# EAGLE design CIRCLE (EAGLE 9.6.2)
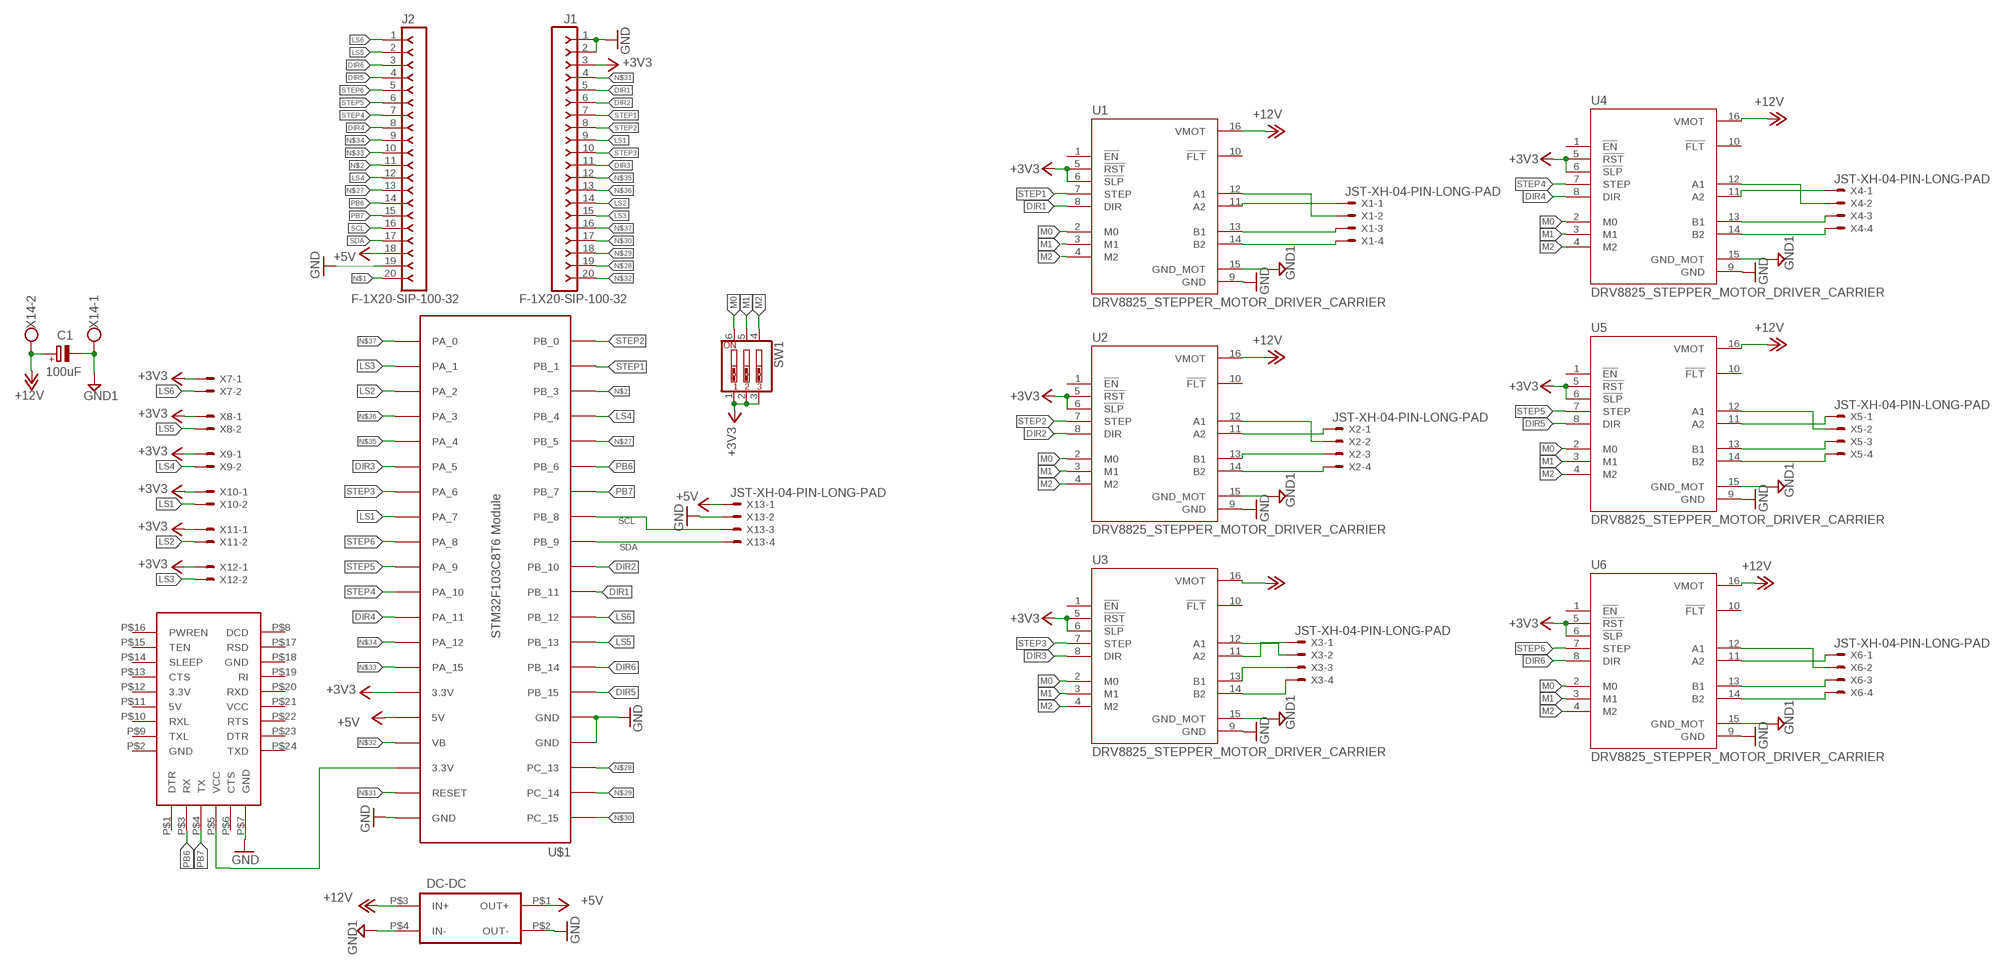
[diagram p0: schematic, sheet 1]

## Parts
C1  100uF  CPOL-EUE3.5-8  [E3,5-8]
J1  F-1X20-SIP-100-32  [SIP-100-20-32]
J2  F-1X20-SIP-100-32  [SIP-100-20-32]
SW1  SW_DIP-3  [EDG-03]
U1  DRV8825_STEPPER_MOTOR_DRIVER_CARRIER  [IC_DRV8825_STEPPER_MOTOR_DRIVER_CARRIER]
U2  DRV8825_STEPPER_MOTOR_DRIVER_CARRIER  [IC_DRV8825_STEPPER_MOTOR_DRIVER_CARRIER]
U3  DRV8825_STEPPER_MOTOR_DRIVER_CARRIER  [IC_DRV8825_STEPPER_MOTOR_DRIVER_CARRIER]
U4  DRV8825_STEPPER_MOTOR_DRIVER_CARRIER  [IC_DRV8825_STEPPER_MOTOR_DRIVER_CARRIER]
U5  DRV8825_STEPPER_MOTOR_DRIVER_CARRIER  [IC_DRV8825_STEPPER_MOTOR_DRIVER_CARRIER]
U6  DRV8825_STEPPER_MOTOR_DRIVER_CARRIER  [IC_DRV8825_STEPPER_MOTOR_DRIVER_CARRIER]
U$1  STM32F103C8T6-MODULE  [STM32F103C8T6-MODULE]
U$2  DC-DC_CONV  [DC-DC_CONV]
U$3  FT232RL_FTDI  [FT232RL_FTDI]
X1  JST-XH-04-PIN-LONG-PAD  [JST-XH-04-PACKAGE-LONG-PAD]
X2  JST-XH-04-PIN-LONG-PAD  [JST-XH-04-PACKAGE-LONG-PAD]
X3  JST-XH-04-PIN-LONG-PAD  [JST-XH-04-PACKAGE-LONG-PAD]
X4  JST-XH-04-PIN-LONG-PAD  [JST-XH-04-PACKAGE-LONG-PAD]
X5  JST-XH-04-PIN-LONG-PAD  [JST-XH-04-PACKAGE-LONG-PAD]
X6  JST-XH-04-PIN-LONG-PAD  [JST-XH-04-PACKAGE-LONG-PAD]
X7  JST-XH-02-PIN-LONG-PAD  [JST-XH-02-PACKAGE-LONG-PAD]
X8  JST-XH-02-PIN-LONG-PAD  [JST-XH-02-PACKAGE-LONG-PAD]
X9  JST-XH-02-PIN-LONG-PAD  [JST-XH-02-PACKAGE-LONG-PAD]
X10  JST-XH-02-PIN-LONG-PAD  [JST-XH-02-PACKAGE-LONG-PAD]
X11  JST-XH-02-PIN-LONG-PAD  [JST-XH-02-PACKAGE-LONG-PAD]
X12  JST-XH-02-PIN-LONG-PAD  [JST-XH-02-PACKAGE-LONG-PAD]
X13  JST-XH-04-PIN-LONG-PAD  [JST-XH-04-PACKAGE-LONG-PAD]
X14  W237-102  [W237-102]

## Nets
+3V3: J1.3 SW1.1 SW1.2 SW1.3 U1.5(!RST) U1.6(!SLP) U2.5(!RST) U2.6(!SLP) U3.5(!RST) U3.6(!SLP) U4.5(!RST) U4.6(!SLP) U5.5(!RST) U5.6(!SLP) U6.5(!RST) U6.6(!SLP) U$1.3.3V@2(3.3V) X7.1 X8.1 X9.1 X10.1 X11.1 X12.1
+5V: J2.18 U$1.5V U$2.P$1(OUT+) X13.1
+12V: C1.+ U1.16(VMOT) U2.16(VMOT) U3.16(VMOT) U4.16(VMOT) U5.16(VMOT) U6.16(VMOT) U$2.P$3(IN+) X14.2
DIR1: J1.5 U1.8(DIR) U$1.PB_11
DIR2: J1.6 U2.8(DIR) U$1.PB_10
DIR3: J1.11 U3.8(DIR) U$1.PA_5
DIR4: J2.8 U4.8(DIR) U$1.PA_11
DIR5: J2.4 U5.8(DIR) U$1.PB_15
DIR6: J2.3 U6.8(DIR) U$1.PB_14
GND: J1.1 J1.2 J2.19 U1.9(GND) U2.9(GND) U3.9(GND) U4.9(GND) U5.9(GND) U6.9(GND) U$1.GND@1(GND) U$1.GND@2(GND) U$1.GND@3(GND) U$2.P$2(OUT-) U$3.P$7(GND) X13.2
GND1: C1.- U1.15(GND_MOT) U2.15(GND_MOT) U3.15(GND_MOT) U4.15(GND_MOT) U5.15(GND_MOT) U6.15(GND_MOT) U$2.P$4(IN-) X14.1
LS1: J1.9 U$1.PA_7 X10.2
LS2: J1.14 U$1.PA_2 X11.2
LS3: J1.15 U$1.PA_1 X12.2
LS4: J2.12 U$1.PB_4 X9.2
LS5: J2.2 U$1.PB_13 X8.2
LS6: J2.1 U$1.PB_12 X7.2
M0: SW1.6 U1.2(M0) U2.2(M0) U3.2(M0) U4.2(M0) U5.2(M0) U6.2(M0)
M1: SW1.5 U1.3(M1) U2.3(M1) U3.3(M1) U4.3(M1) U5.3(M1) U6.3(M1)
M2: SW1.4 U1.4(M2) U2.4(M2) U3.4(M2) U4.4(M2) U5.4(M2) U6.4(M2)
N$1: J2.20 U$1.3.3V@1(3.3V) U$3.P$5(VCC)
N$2: J2.11 U$1.PB_3
N$3: U1.14(B2) X1.4
N$4: U1.13(B1) X1.3
N$5: U1.12(A1) X1.2
N$6: U1.11(A2) X1.1
N$7: U2.14(B2) X2.4
N$8: U2.13(B1) X2.3
N$9: U2.11(A2) X2.1
N$10: U2.12(A1) X2.2
N$11: U4.14(B2) X4.4
N$12: U4.13(B1) X4.3
N$13: U4.11(A2) X4.1
N$14: U4.12(A1) X4.2
N$15: U5.14(B2) X5.4
N$16: U5.13(B1) X5.3
N$17: U5.11(A2) X5.1
N$18: U5.12(A1) X5.2
N$19: U6.14(B2) X6.4
N$20: U6.13(B1) X6.3
N$21: U6.11(A2) X6.1
N$22: U6.12(A1) X6.2
N$23: U3.14(B2) X3.4
N$24: U3.13(B1) X3.3
N$25: U3.11(A2) X3.1
N$26: U3.12(A1) X3.2
N$27: J2.13 U$1.PB_5
N$28: J1.19 U$1.PC_13
N$29: J1.18 U$1.PC_14
N$30: J1.17 U$1.PC_15
N$31: J1.4 U$1.RESET
N$32: J1.20 U$1.VB
N$33: J2.10 U$1.PA_15
N$34: J2.9 U$1.PA_12
N$35: J1.12 U$1.PA_4
N$36: J1.13 U$1.PA_3
N$37: J1.16 U$1.PA_0
PB6: J2.14 U$1.PB_6 U$3.P$3(RX)
PB7: J2.15 U$1.PB_7 U$3.P$4(TX)
SCL: J2.16 U$1.PB_8 X13.3
SDA: J2.17 U$1.PB_9 X13.4
STEP1: J1.7 U1.7(STEP) U$1.PB_1
STEP2: J1.8 U2.7(STEP) U$1.PB_0
STEP3: J1.10 U3.7(STEP) U$1.PA_6
STEP4: J2.7 U4.7(STEP) U$1.PA_10
STEP5: J2.6 U5.7(STEP) U$1.PA_9
STEP6: J2.5 U6.7(STEP) U$1.PA_8
Unconnected: U1.1(!EN) U1.10(!FLT) U2.1(!EN) U2.10(!FLT) U3.1(!EN) U3.10(!FLT) U4.1(!EN) U4.10(!FLT) U5.1(!EN) U5.10(!FLT) U6.1(!EN) U6.10(!FLT) U$3.P$1(DTR) U$3.P$2(GND) U$3.P$6(CTS) U$3.P$8(DCD) U$3.P$9(TXL) U$3.P$10(RXL) U$3.P$11(5V) U$3.P$12(3.3V) U$3.P$13(CTS) U$3.P$14(SLEEP) U$3.P$15(TEN) U$3.P$16(PWREN) U$3.P$17(RSD) U$3.P$18(GND) U$3.P$19(RI) U$3.P$20(RXD) U$3.P$21(VCC) U$3.P$22(RTS) U$3.P$23(DTR) U$3.P$24(TXD)

## Library data of the parts
C1 = rcl:CPOL-EU: POLARIZED CAPACITOR, European symbol; SPICEPREFIX: C
J1 J2 = con-headers-jp female:F-1X20-: FEMALE HEADER
SW1 = special:SW_DIP-3: DIP SWITCH
U1-U6 = DRV8825_STEPPER_MOTOR_DRIVER_CARRIER:DRV8825_STEPPER_MOTOR_DRIVER_CARRIER: Stepper motor controler; IC: DRV8825; 1.5A; Uin mot: 8.2÷45V; AVAILABILITY: Unavailable; DESCRIPTION: Stepper, Bipolar 8.2 ~ 45VDC Supply 1.5A 8.2 ~ 45V Load; MF: Pololu; MP: DRV8825 STEPPER MOTOR DRIVER CARRIER; PACKAGE: None; PRICE: None
U$1 = STM32 F103C8T6:STM32F103C8T6-MODULE: STM32F103C8T6 module with ARM Cortex-3, 20kB SRAM, 64kB Flash, 72MHz
U$2 = MINI360:DC-DC_CONV
U$3 = FT232RL_FTDI:FT232RL_FTDI
X1-X6 X13 = Rembrandt Electronics - JST XH Connectors v1-0:JST-XH-04-PIN: JST XH Connector 2 Pin Wire to board connector. Pitch: 2,54 mm, (0.100") Number of pins: 4 Created by Rembrandt Electronics www.rembrandtelectronics.com
X7-X12 = Rembrandt Electronics - JST XH Connectors v1-0:JST-XH-02-PIN: JST XH Connector 2 Pin Wire to board connector. Pitch: 2,54 mm, (0.100") Number of pins: 2 Created by Rembrandt Electronics www.rembrandtelectronics.com
X14 = con-wago-500:W237-102: WAGO SCREW CLAMP; MPN: 237-102; OC_FARNELL: unknown; OC_NEWARK: 70K9898

## Board
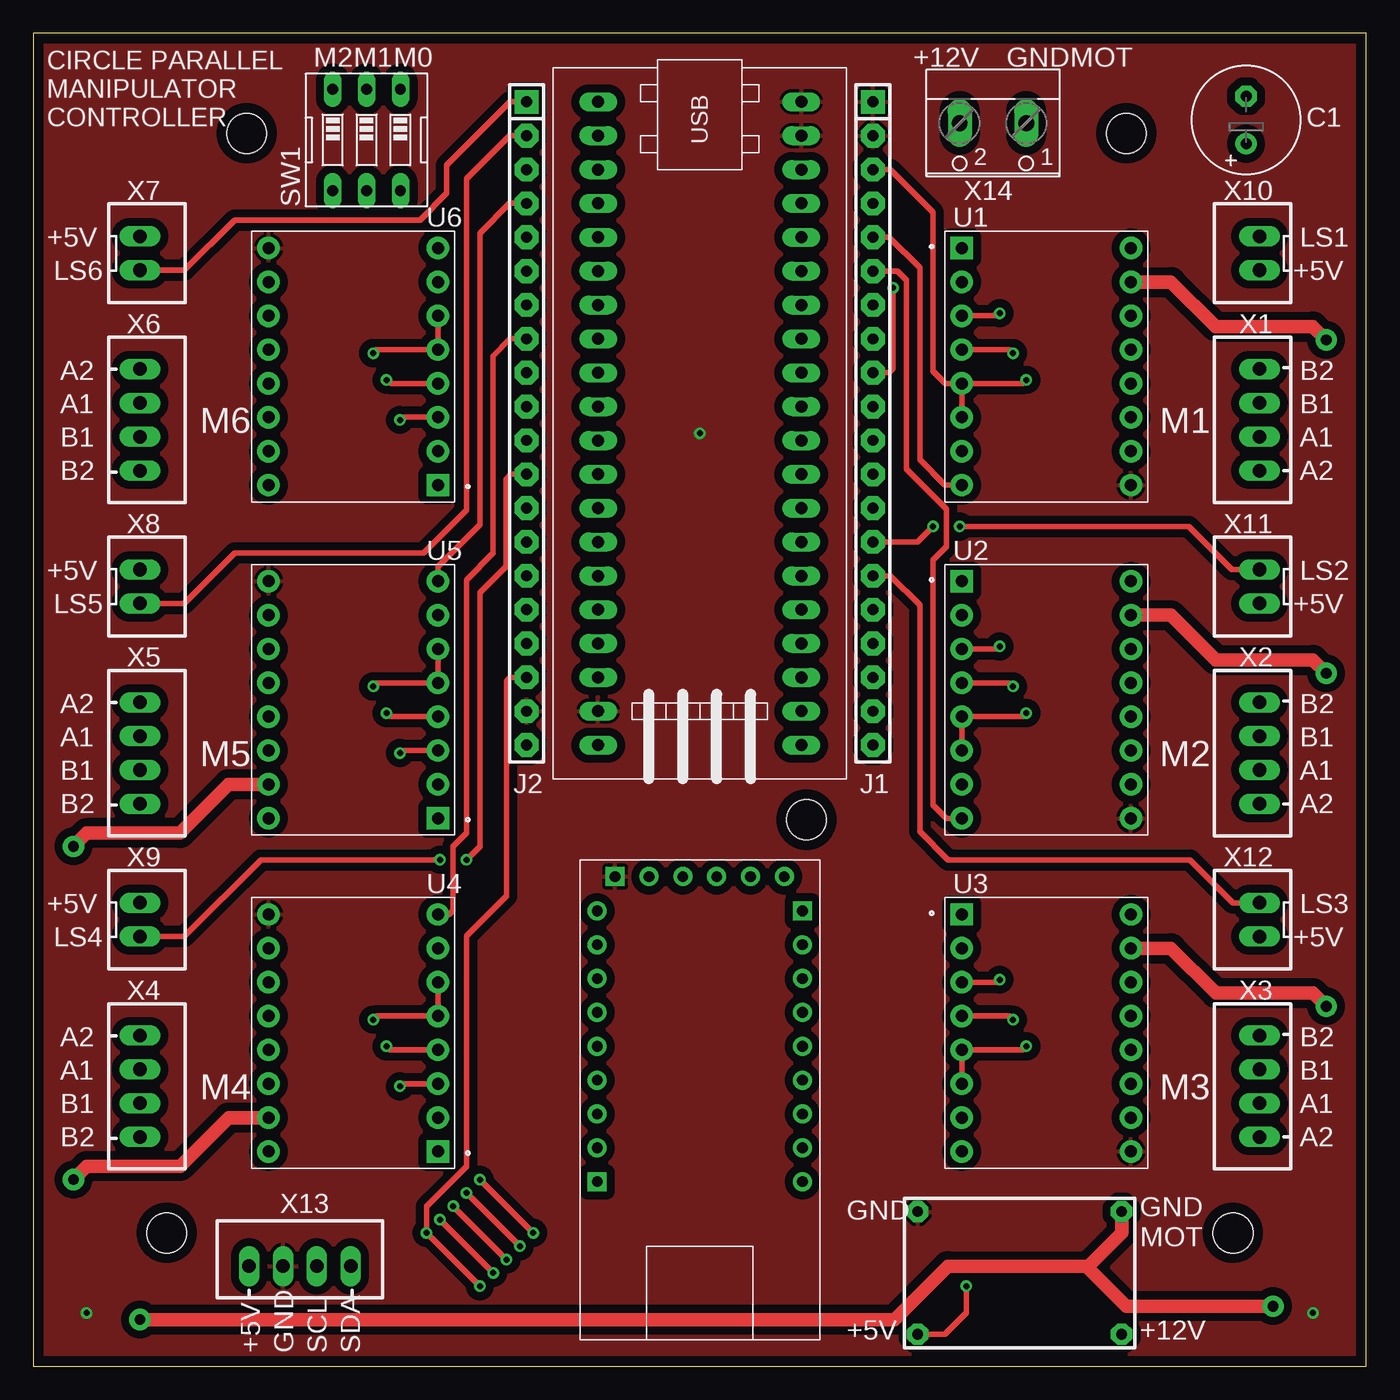
[diagram p1: board, top side]
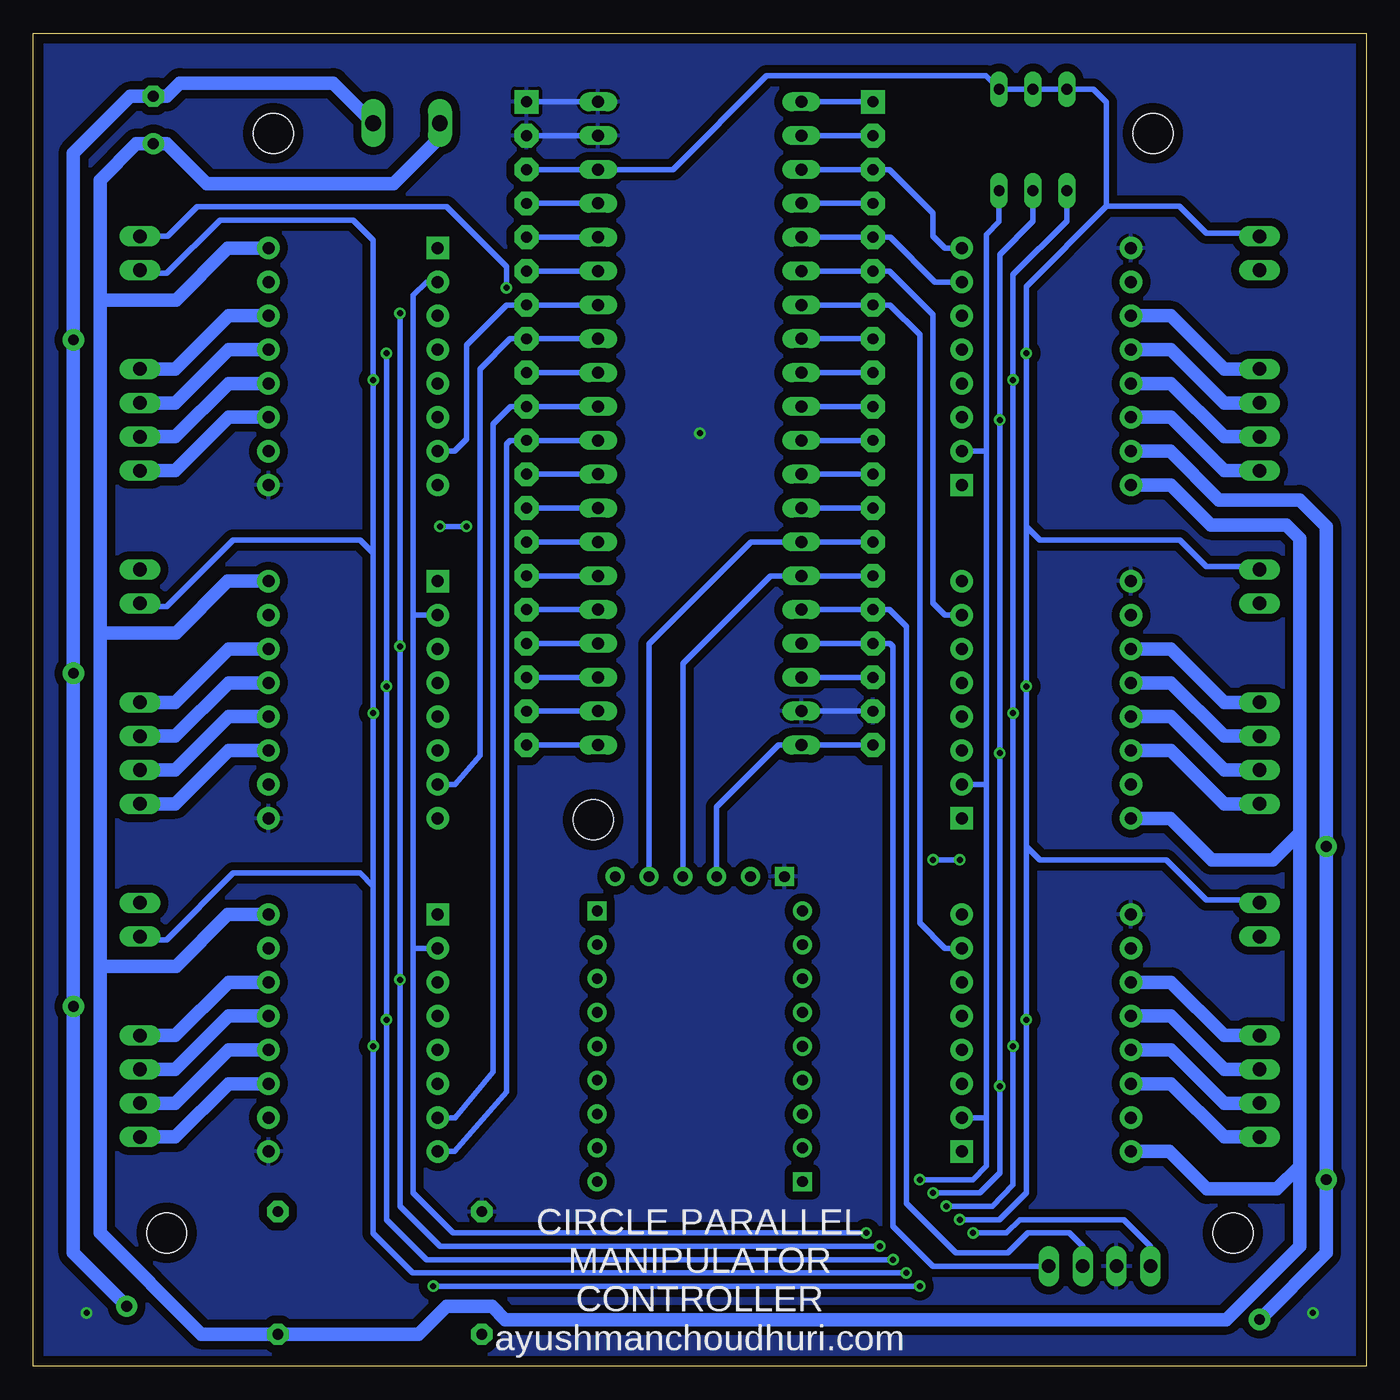
[diagram p2: board, bottom side, seen from below]

Size 100 x 100 mm. Coordinates in mm from the lower left corner, seen from the top.
Outline: 0,100 0,0 100,0 100,100 0,100
Copper layers (1*16): Top 0.035mm / dielectric 1.5mm / Bottom 0.035mm
Design rules "default *": minimum track width 6mil, minimum drill 0.35mm, track to track 6mil, track to pad 6mil, pad to pad 6mil, via to via 6mil, smd to smd 6mil, copper to edge 30mil, drill to drill 6mil, minimum pad ring 10mil, minimum via ring 8mil, stop-mask expansion 4mil, vias tented up to drill 0mil, thermal gap 10mil
Holes 3 mm at 82,92.5 58,41 90,10 10,10 16,92.5

### Footprints (pad centres in the part's own frame; a part is rotated, then mirrored left to right if it is on the bottom)
E3,5-8 = drill 0.813 pad 1.6: + -1.778,0 | drill 0.813 pad 1.6 octagon: - 1.778,0
SIP-100-20-32 = drill 0.813 pad 1.778 square: 1 -24.13,0 | drill 0.813 pad 1.778 octagon: 2 -21.59,0; 3 -19.05,0; 4 -16.51,0; 5 -13.97,0; 6 -11.43,0; 7 -8.89,0; 8 -6.35,0; 9 -3.81,0; 10 -1.27,0; 11 1.27,0; 12 3.81,0; 13 6.35,0; 14 8.89,0; 15 11.43,0; 16 13.97,0; 17 16.51,0; 18 19.05,0; 19 21.59,0; 20 24.13,0
EDG-03 = drill 0.813 long: 1 -2.54,-3.81; 2 0,-3.81; 3 2.54,-3.81; 4 2.54,3.81; 5 0,3.81; 6 -2.54,3.81
IC_DRV8825_STEPPER_MOTOR_DRIVER_CARRIER = drill 0.9 pad 1.676 square: 1 -6.35,8.89 | drill 0.9 pad 1.676: 2 -6.35,6.35; 3 -6.35,3.81; 4 -6.35,1.27; 5 -6.35,-1.27; 6 -6.35,-3.81; 7 -6.35,-6.35; 8 -6.35,-8.89; 9 6.35,-8.89; 10 6.35,-6.35; 11 6.35,-3.81; 12 6.35,-1.27; 13 6.35,1.27; 14 6.35,3.81; 15 6.35,6.35; 16 6.35,8.89
STM32F103C8T6-MODULE = drill 0.9 long: 3.3V@1 25.4,-7.62; 3.3V@2 -17.78,7.62; 5V 20.32,-7.62; GND@1 22.86,-7.62; GND@2 -20.32,7.62; GND@3 -22.86,7.62; PA_0 15.24,7.62; PA_1 12.7,7.62; PA_2 10.16,7.62; PA_3 7.62,7.62; PA_4 5.08,7.62; PA_5 2.54,7.62; PA_6 0,7.62; PA_7 -2.54,7.62; PA_8 -12.7,-7.62; PA_9 -10.16,-7.62; PA_10 -7.62,-7.62; PA_11 -5.08,-7.62; PA_12 -2.54,-7.62; PA_15 0,-7.62; PB_0 -5.08,7.62; PB_1 -7.62,7.62; PB_3 2.54,-7.62; PB_4 5.08,-7.62; PB_5 7.62,-7.62; PB_6 10.16,-7.62; PB_7 12.7,-7.62; PB_8 15.24,-7.62; PB_9 17.78,-7.62; PB_10 -10.16,7.62; PB_11 -12.7,7.62; PB_12 -22.86,-7.62; PB_13 -20.32,-7.62; PB_14 -17.78,-7.62; PB_15 -15.24,-7.62; PC_13 22.86,7.62; PC_14 20.32,7.62; PC_15 17.78,7.62; RESET -15.24,7.62; VB 25.4,7.62
DC-DC_CONV = drill 0.8 pad 1.6 octagon: P$1 -4.6,7.65; P$2 4.6,7.65; P$3 -4.6,-7.65; P$4 4.6,-7.65
FT232RL_FTDI = drill 0.8 pad 1.422: P$1 2.651,1.27; P$3 5.191,1.27; P$4 7.731,1.27; P$5 10.271,1.27; P$6 12.811,1.27; P$9 1.3,6.38; P$10 1.3,8.92; P$11 1.3,11.46; P$12 1.3,14; P$13 1.3,16.54; P$14 1.3,19.08; P$15 1.3,21.62; P$16 1.3,24.16; P$17 16.7,21.62; P$18 16.7,19.08; P$19 16.7,16.54; P$20 16.7,14; P$21 16.7,11.46; P$22 16.7,8.92; P$23 16.7,6.38; P$24 16.7,3.84 | drill 0.8 pad 1.422 square: P$2 1.3,3.84; P$7 15.351,1.27; P$8 16.7,24.16
JST-XH-04-PACKAGE-LONG-PAD = drill 1.016 long: 1 -3.81,0; 2 -1.27,0; 3 1.27,0; 4 3.81,0
JST-XH-02-PACKAGE-LONG-PAD = drill 1.016 long: 1 -1.27,0; 2 1.27,0
W237-102 = drill 1.194 long: 1 -2.5,-1.27; 2 2.5,-1.27

### Placement (x,y rotation side)
C1  91,93.5 90 top
J1  63,70.73 270 top
J2  37,70.73 270 top
SW1  25,92 180 top
U1  76,75 0 top
U2  76,50 0 top
U3  76,25 0 top
U4  24,25 180 top
U5  24,50 180 top
U6  24,75 180 top
U$1  50,72 270 top
U$2  74,7 90 top
U$3  59,38 180 top
X1  92,71 90 top
X2  92,46 90 top
X3  92,21 90 top
X4  8,21 270 top
X5  8,46 270 top
X6  8,71 270 top
X7  8,83.5 270 top
X8  8,58.5 270 top
X9  8,33.5 270 top
X10  92,83.5 90 top
X11  92,58.5 90 top
X12  92,33.5 90 top
X13  20,7.5 0 top
X14  72,92 180 top

### Tracks (layer width: path | path; a pad name or v marks a point on that pad's centre or on a via)
+3V3  (via drill 0.45)
  Top 0.406: v30.5,11 v34.5,7 | v74.5,74 74.23,73.73 U1.5 | v74.5,49 74.23,48.73 U2.5 U2.6 | v74.5,24 74.23,23.73 U3.5 U3.6 | U4.5 30,26.27 | 30,26.27 25.77,26.27 v25.5,26 | v25.5,51 25.77,51.27 U5.5 U5.6 | v25.5,76 25.77,76.27 U6.5 U6.6 | U4.6 30.35,26.62 30,26.27 | U1.5 U1.6 | J1.3 64.3,89.78 67.5,86.58 67.5,74.65 68.42,73.73 U1.5
  Bottom 0.406: 19.5,87.01 25.5,80.98 v25.5,76 25.5,63 | 19.5,87.01 19.5,94.85 20.46,95.81 SW1.3 SW1.2 SW1.1 28.54,96.81 44.99,96.81 52.02,89.78 U$1.3.3V@2 J1.3 | 25.5,63 v25.5,51 25.5,39 | 25.5,39 v25.5,26 25.5,13.01 27.5,11 v30.5,11 | 74.5,36 74.5,37 v74.5,49 74.5,61 | 74.5,36 v74.5,24 74.5,9.97 71.53,7 v34.5,7 | 74.5,61 v74.5,74 74.5,84.5 76,86 86,86 90,82 91.77,82 X10.1 | X8.1 8.23,60 12,60 14,62 24.5,62 25.5,63 | 25.5,39 24.5,38 15,38 12,35 8.23,35 X9.1 | X7.1 8.23,85 12,85 14.01,87.01 19.5,87.01 | X12.1 91.77,32 90,32 85,37 76,37 75.5,37 74.5,36 | X11.1 91.77,57 90,57 85,62 75.5,62 74.5,61
+5V  (via drill 0.45)
  Top 0.406: v33.5,6 v29.5,10 29.5,12 32.5,15 32.5,32.3 35.5,35.3 35.5,51.4 35.78,51.68 J2.18 | U$2.P$1 68.4,2.4 70,4 v70,6
  Bottom 0.406: v29.5,10 27,10 26,11 18.19,11 16.19,9 X13.1 | v33.5,6 v70,6 | J2.18 U$1.5V
+12V
  Bottom 1.016: 95,80 95,89 92.28,91.72 C1.+ 90,91.72 87,88.72 72.98,88.72 69.5,92.2 X14.2 | 95,80 95,55 | 5,15 5,9 10.5,3.5 64.6,3.5 65.6,4.5 69,4.5 71.1,2.4 U$2.P$3 87.4,2.4 95,10 95,30 | 5,15 5,40 | 5,40 5,62.11 6,63.11 11.65,63.11 14.65,66.11 U6.16 | 95,30 89.3,30 85.41,33.89 U3.16 | 95,55 89.3,55 85.41,58.89 U2.16 | 95,80 89.3,80 85.41,83.89 U1.16 | 95,30 95,55 | U5.16 14.71,41.11 11.6,38 7,38 5,40 | U4.16 14.76,16.11 11.95,13.3 6.7,13.3 5,15
DIR1
  Top 0.406: U1.8 68.4,66.11 66.5,68.01 66.5,82.4 64.2,84.7 J1.5
  Bottom 0.406: U$1.PB_11 J1.5
DIR2
  Top 0.406: U2.8 68.5,41.11 67.5,42.11 67.5,60.5 68.5,61.5 68.5,64.3 65.5,67.3 65.5,81.5 64.84,82.16 J1.6
  Bottom 0.406: U$1.PB_10 J1.6
DIR3
  Bottom 0.406: U3.8 68.41,16.11 64.5,20.58 64.5,69.2 64.24,69.46 J1.11 U$1.PA_5
DIR4
  Top 0.406: U4.8 31.2,33.89 31.5,34.19 31.5,39 32.5,40 32.5,59 34.5,61 34.5,75.8 35.78,77.08 J2.8
  Bottom 0.406: J2.8 U$1.PA_11
DIR5
  Top 0.406: U5.8 30.35,60 33.5,63.15 33.5,85 35.74,87.24 J2.4
  Bottom 0.406: J2.4 U$1.PB_15
DIR6
  Bottom 0.406: U$1.PB_14 J2.3 35.78,89.78 32.5,86.5 32.5,84.8 31.59,83.89 U6.8
GND  (via drill 0.45)
  Bottom 0.406: J2.19 U$1.GND@1 | U$1.GND@3 J1.1 | U$1.GND@2 J1.2
  other vias: 96,4 4,4 50,70
  pour Bottom (isolate 0.61): -5,100 103,100 103,0 -5,0
  pour Top (isolate 0.61): -3,100 102,100 102,0 -3,0
GND1  (via drill 0.8 pad 1.6)
  Top 1.016: U5.15 14.65,43.65 11,40 4,40 v3,39 | U4.15 14.65,18.65 11,15 4,15 v3,14 | U3.15 85.35,31.35 88.7,28 96,28 v97,27 | U2.15 85.35,56.35 88.7,53 96,53 v97,52 | U1.15 85.35,81.35 88.7,78 96,78 v97,77 | v93,4.5 82,4.5 79.08,7.42 | v8,3.5 64.6,3.5 68.6,7.5 79,7.5 79.08,7.42 | U$2.P$4 81.65,10 79.08,7.42
  Bottom 1.016: X14.1 77.5,96.27 89.01,96.27 90,95.28 C1.- 92.72,95.28 97,91 v97,77 v97,52 v97,27 97,8.5 v93,4.5 | v8,3.5 3,8.5 v3,14 v3,39 3,63 5,65 11.05,65 14.7,68.65 U6.15
LS1  (via drill 0.45)
  Top 0.406: v64.5,80.9 64.5,74.84 64.2,74.54 J1.9
  Bottom 0.406: v64.5,80.9 64.5,82.5 69,87 87.7,87 89.93,84.77 X10.2 | U$1.PA_7 J1.9
LS2  (via drill 0.45)
  Top 0.406: X11.2 89.93,59.77 86.7,63 v69.5,63 | J1.14 66.34,61.84 v67.5,63
  Bottom 0.406: v69.5,63 v67.5,63 | U$1.PA_2 J1.14
LS3
  Top 0.406: X12.2 90,34.77 86.77,38 68.6,38 66.5,40.1 66.5,57.1 64.3,59.3 J1.15
  Bottom 0.406: U$1.PA_1 J1.15
LS4  (via drill 0.45)
  Top 0.406: v32.5,38 33.5,39 33.5,58.04 35.46,60 35.46,66.56 35.82,66.92 J2.12 | X9.2 11.33,32.23 17.1,38 v30.5,38
  Bottom 0.406: v32.5,38 v30.5,38 | J2.12 U$1.PB_4
LS5
  Top 0.406: X8.2 11.33,57.23 15.1,61 29.27,61 32.5,64.23 32.5,89.1 35.72,92.32 J2.2
  Bottom 0.406: J2.2 U$1.PB_13
LS6
  Top 0.406: X7.2 11.33,82.23 15.1,86 29,86 31,88 31,90.1 35.76,94.86 J2.1
  Bottom 0.406: J2.1 U$1.PB_12
M0  (via drill 0.45)
  Top 0.406: v37.5,10 v33.5,14
  Bottom 0.406: SW1.6 27.54,85.87 28.5,84.89 28.5,68.65 | 28.5,68.65 28.5,43.65 | 28.5,43.65 28.5,18.65 | 28.5,18.65 28.5,15.02 29.5,14 v33.5,14 | v37.5,10 68.5,10 71.5,13 71.5,31.35 | 71.5,31.35 71.5,56.35 | 71.5,56.35 71.5,80.35 70.5,81.35 U1.2 | U6.2 28.5,68.65 | U5.2 28.5,43.65 | U4.2 28.5,18.65 | U3.2 71.5,31.35 | U2.2 71.5,56.35
M1  (via drill 0.45)
  Top 0.406: v36.5,9 v32.5,13 | v72.5,79 72.31,78.81 U1.3 | U2.3 72.31,53.81 v72.5,54 | U3.3 72.31,28.81 v72.5,29 | U6.3 27.69,71.19 v27.5,71 | U5.3 27.69,46.19 v27.5,46 | U4.3 27.69,21.19 v27.5,21
  Bottom 0.406: SW1.5 25,85.89 27.5,83.39 v27.5,71 v27.5,46 v27.5,21 27.5,14.5 29,13 v32.5,13 | v36.5,9 69.5,9 72.5,12 v72.5,29 v72.5,54 v72.5,79
M2  (via drill 0.45)
  Top 0.406: v35.5,8 v31.5,12 | v73.5,76 73.23,76.27 U1.4 | U2.4 73.23,51.27 v73.5,51 | U3.4 73.23,26.27 v73.5,26 | U4.4 26.73,23.73 v26.5,24 | U5.4 26.83,48.73 v26.5,49 | U6.4 26.83,73.73 v26.5,74
  Bottom 0.406: SW1.4 22.46,85.91 26.5,81.9 v26.5,74 v26.5,49 v26.5,24 26.5,13.59 28.05,12 v31.5,12 | v35.5,8 70.5,8 73.5,11 v73.5,26 v73.5,51 v73.5,76
N$1
  Bottom 0.406: U$3.P$5 48.73,41.97 44.1,46.6 U$1.3.3V@1 J2.20
N$2
  Bottom 0.406: J2.11 U$1.PB_3
N$3
  Bottom 1.016: X1.4 89.35,74.81 85.35,78.81 U1.14
N$4
  Bottom 1.016: X1.3 89.35,72.27 85.35,76.27 U1.13
N$5
  Bottom 1.016: X1.2 89.35,69.73 85.35,73.73 U1.12
N$6
  Bottom 1.016: X1.1 89.35,67.19 85.35,71.19 | 85.35,71.19 U1.11 85.35,71.19
N$7
  Bottom 1.016: X2.4 89.35,49.81 85.35,53.81 U2.14
N$8
  Bottom 1.016: X2.3 89.35,47.27 85.35,51.27 U2.13
N$9
  Bottom 1.016: X2.1 89.35,42.19 85.35,46.19 U2.11
N$10
  Bottom 1.016: X2.2 89.35,44.73 85.35,48.73 U2.12
N$11
  Bottom 1.016: U4.14 14.65,21.19 10.65,17.19 X4.4
N$12
  Bottom 1.016: U4.13 14.65,23.73 10.65,19.73 X4.3
N$13
  Bottom 1.016: U4.11 14.65,28.81 10.65,24.81 X4.1
N$14
  Bottom 1.016: U4.12 14.65,26.27 10.65,22.27 X4.2
N$15
  Bottom 1.016: U5.14 14.65,46.19 10.65,42.19 X5.4
N$16
  Bottom 1.016: U5.13 14.65,48.73 10.65,44.73 X5.3
N$17
  Bottom 1.016: U5.11 14.65,53.81 10.65,49.81 X5.1
N$18
  Bottom 1.016: U5.12 14.65,51.27 10.65,47.27 X5.2
N$19
  Bottom 1.016: U6.14 14.65,71.19 10.65,67.19 X6.4
N$20
  Bottom 1.016: U6.13 14.65,73.73 10.65,69.73 X6.3
N$21
  Bottom 1.016: U6.11 14.65,78.81 10.65,74.81 X6.1
N$22
  Bottom 1.016: U6.12 14.65,76.27 10.65,72.27 X6.2
N$23
  Bottom 1.016: X3.4 89.35,24.81 85.35,28.81 U3.14
N$24
  Bottom 1.016: X3.3 89.35,22.27 85.35,26.27 U3.13
N$25
  Bottom 1.016: X3.1 89.35,17.19 85.35,21.19 U3.11
N$26
  Bottom 1.016: X3.2 89.35,19.73 85.35,23.73 U3.12
N$27
  Bottom 0.406: J2.13 U$1.PB_5
N$28
  Bottom 0.406: U$1.PC_13 J1.19
N$29
  Bottom 0.406: U$1.PC_14 J1.18
N$30
  Bottom 0.406: U$1.PC_15 J1.17
N$31
  Bottom 0.406: U$1.RESET J1.4
N$32
  Bottom 0.406: U$1.VB J1.20
N$33
  Bottom 0.406: J2.10 U$1.PA_15
N$34
  Bottom 0.406: J2.9 U$1.PA_12
N$35
  Bottom 0.406: U$1.PA_4 J1.12
N$36
  Bottom 0.406: U$1.PA_3 J1.13
N$37
  Bottom 0.406: U$1.PA_0 J1.16
PB6
  Bottom 0.406: J2.14 U$1.PB_6 46.16,61.84 53.81,54.19 U$3.P$3
PB7
  Bottom 0.406: J2.15 U$1.PB_7 44.7,59.3 51.27,52.73 U$3.P$4
SCL
  Bottom 0.406: X13.3 21.27,9 22.27,10 25.37,10 26.87,8.5 30.77,8.5 34.5,12.23 34.5,55.5 35.76,56.76 J2.16 U$1.PB_8
SDA
  Bottom 0.406: X13.4 32.5,7.5 35.5,10.5 35.5,54 35.72,54.22 J2.17 U$1.PB_9
STEP1
  Bottom 0.406: U1.7 68.4,68.65 67.5,69.55 67.5,76.6 64.48,79.62 J1.7 U$1.PB_1
STEP2
  Bottom 0.406: U2.7 68.35,43.65 66.5,45.83 66.5,74.8 64.22,77.08 J1.8 U$1.PB_0
STEP3
  Bottom 0.406: U3.7 68.35,18.65 65.5,22.07 65.5,70.7 64.2,72 J1.10 U$1.PA_6
STEP4
  Bottom 0.406: U4.7 31.6,31.35 33.5,33.25 33.5,77.4 35.72,79.62 J2.7 U$1.PA_10
STEP5
  Bottom 0.406: U5.7 31.6,56.35 32.5,57.25 32.5,78.9 35.76,82.16 J2.6 U$1.PA_9
STEP6
  Bottom 0.406: U$1.PA_8 J2.5 35.7,84.7 32.35,81.35 U6.7

### Text on the board
tNames: M2 | M1 | M0 | +12V | GNDMOT | CIRCLE PARALLEL / MANIPULATOR / CONTROLLER | +5V | LS1 | LS6 | +5V | A2 | B2 | A1 | B1 | M6 | M1 | B1 | A1 | B2 | A2 | +5V | LS2 | LS5 | +5V | A2 | B2 | A1 | B1 | M5 | M2 | B1 | A1 | B2 | A2 | +5V | LS3 | LS4 | +5V | A2 | B2 | A1 | B1 | M4 | M3 | B1 | A1 | B2 | A2 | GND | GND / MOT | +5V | +12V | +5V | GND | SCL | SDA
bNames: CIRCLE PARALLEL / MANIPULATOR / CONTROLLER / ayushmanchoudhuri.com